# Altium schematic sheet MCU.SchDoc
size 250 x 149 mm; DocumentNumber: 1; SheetNumber: 1; SheetTotal: 11
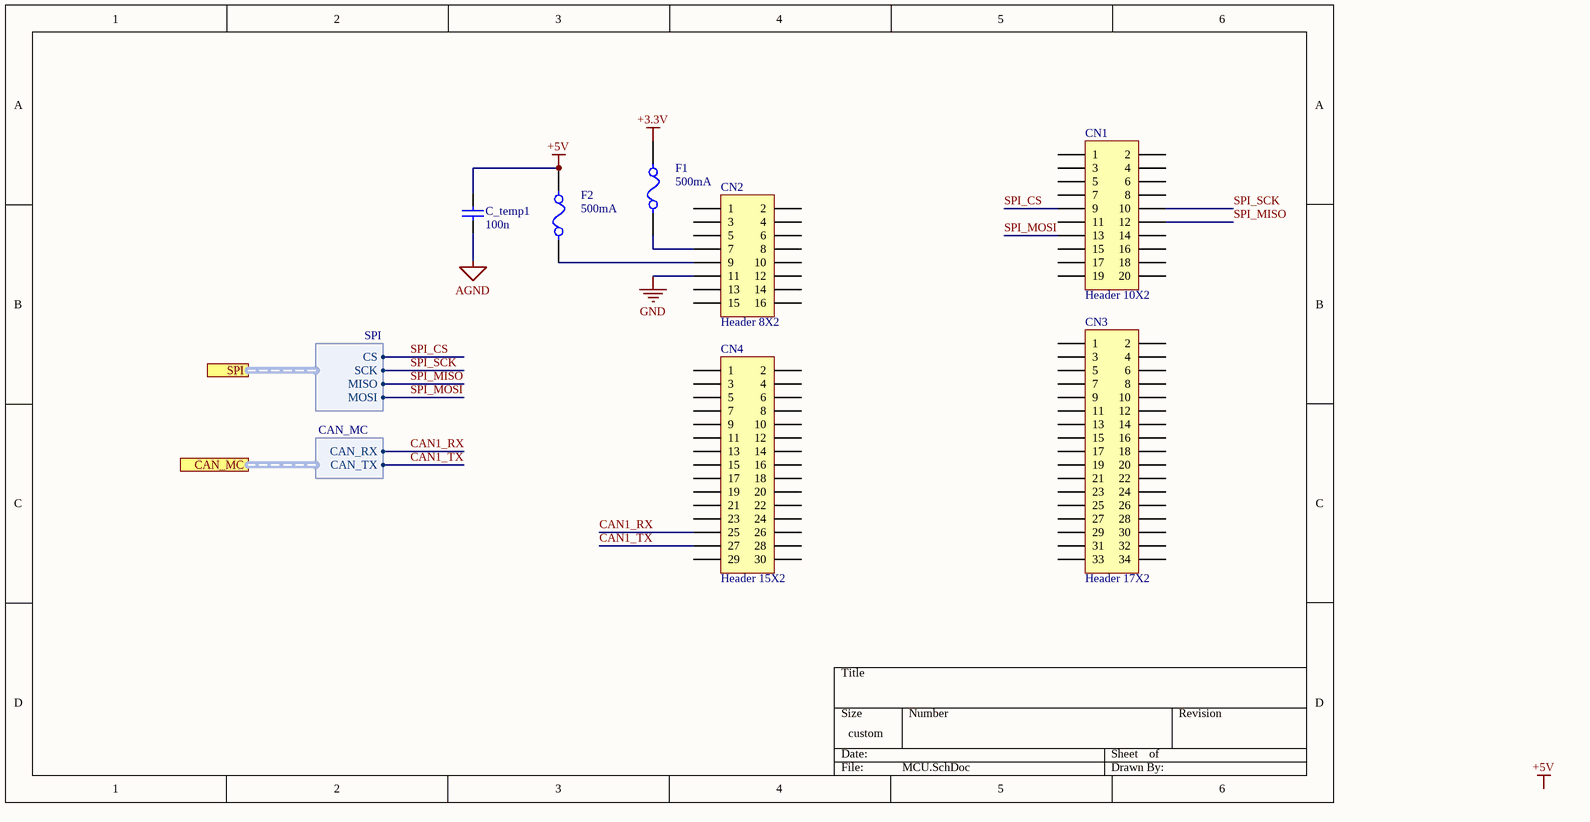
[diagram p0: MCU.SchDoc]

## Parts
C_temp1  100n  [CAPC0603(1608)55_N]
CN1  Header 10X2  [HDR2X10]
CN2  Header 8X2  [HDR2X8]
CN3  Header 17X2  [HDR2X17]
CN4  Header 15X2  [HDR2X15]
F1  500mA  [Fuse_500_mA]
F2  500mA  [Fuse_500_mA]

## Ports
CAN_MC (harness CAN_MC), SPI (harness SPI)

## Harnesses
SPI: CS, SCK, MISO, MOSI
CAN_MC: CAN_RX, CAN_TX

## Nets
+3.3V: F1.2
+5V: C_temp1.1 F2.2
AGND: C_temp1.2
GND: CN2.11
CAN1_RX: CN4.25 ; port CAN_MC.CAN_RX
CAN1_TX: CN4.27 ; port CAN_MC.CAN_TX
SPI_CS: CN1.9 ; port SPI.CS
SPI_MISO: CN1.12 ; port SPI.MISO
SPI_MOSI: CN1.13 ; port SPI.MOSI
SPI_SCK: CN1.10 ; port SPI.SCK
NetCN2_7: CN2.7 F1.1
NetCN2_9: CN2.9 F2.1

Not connected (* = marked no-connect by the designer): CN1 1 2 3 4 5 6 7 8 11 14 15 16 17 18 19 20; CN2 1 2 3 4 5 6 8 10 12 13 14 15 16; CN3 1 2 3 4 5 6 7 8 9 10 11 12 13 14 15 16 17 18 19 20 21 22 23 24 25 26 27 28 29 30 31 32 33 34; CN4 1 2 3 4 5 6 7 8 9 10 11 12 13 14 15 16 17 18 19 20 21 22 23 24 26 28 29 30

## Notes on the sheet
- Labels drawn without touching a wire or pin: +5V

## Library data of the parts
C_temp1 = Cap 100n: Keramikvielschichtkondensator, SMD, Baureihe MC, ± 10%; Manufacturer: TDK; Voltage Rating: 50V; OC_MOUSER: CGA3E2X7R1H104K080AA; Value: 100n; PackageReference: 0603; Tolerance: ± 10%
CN1 = Header 10X2: Header, 10-Pin, Dual row; LatestRevisionDate: 17-Jul-2002; LatestRevisionNote: Re-released for DXP Platform.; Publisher: Altium Limited
CN2 = Header 8X2: Header, 8-Pin, Dual row; LatestRevisionDate: 17-Jul-2002; LatestRevisionNote: Re-released for DXP Platform.; Publisher: Altium Limited
CN3 = Header 17X2: Header, 17-Pin, Dual row; LatestRevisionDate: 17-Jul-2002; LatestRevisionNote: Re-released for DXP Platform.; Publisher: Altium Limited
CN4 = Header 15X2: Header, 15-Pin, Dual row; LatestRevisionDate: 17-Jul-2002; LatestRevisionNote: Re-released for DXP Platform.; Publisher: Altium Limited
F1 F2 = Fuse_500mA: 0679H0500-01, Sicherungen zur Aufbaumontage 500mA 350 VAC 72 VCD; Voltage_Rating: 72 VDC; Value: 500mA; OC_Mouser: 530-0679H0500-01